# Altium schematic sheet Sensors.SchDoc
size A4; SheetNumber: 4; SheetTotal: 7
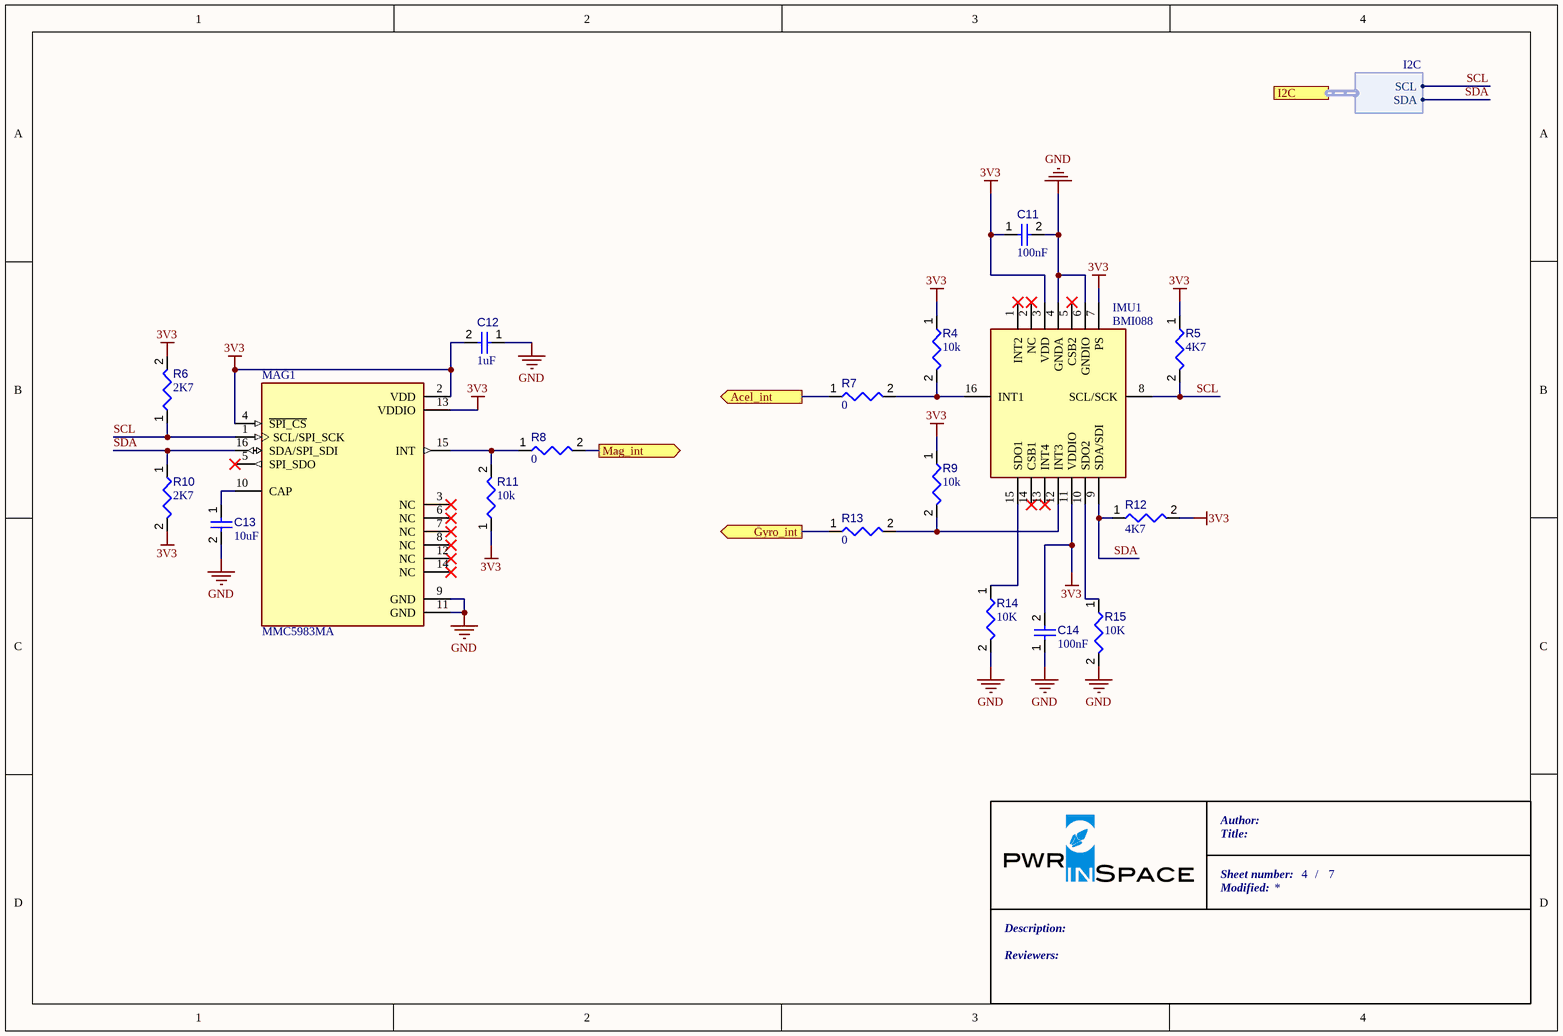
[diagram p0: Sensors.SchDoc]

## Parts
C11  value 100nF  [CAPC0805(2012)145_L]  (hidden comment: Capacitor 100µF +/-20% 6.3V 0805)
C12  value 1uF  [CAPC0805(2012)145_L]  (hidden comment: Capacitor 100µF +/-20% 6.3V 0805)
C13  value 10uF  [CAPC0805(2012)145_L]  (hidden comment: Capacitor 100µF +/-20% 6.3V 0805)
C14  value 100nF  [CAPC0805(2012)145_L]  (hidden comment: Capacitor 100µF +/-20% 6.3V 0805)
IMU1  BMI088  [BMI088]
MAG1  MMC5983MA  [PQFN50P300X300X100-16N]
R4  value 10k  [RESC0805(2012)_L]  (hidden comment: Resistor 4R7  +/-5 % 0805 125 mW)
R5  value 4K7  [RESC0805(2012)_L]  (hidden comment: Resistor 4R7  +/-5 % 0805 125 mW)
R6  value 2K7  [RESC0805(2012)_L]  (hidden comment: Resistor 4R7  +/-5 % 0805 125 mW)
R7  value 0  [RESC0805(2012)_L]  (hidden comment: Resistor 4R7  +/-5 % 0805 125 mW)
R8  value 0  [RESC0805(2012)_L]  (hidden comment: Resistor 4R7  +/-5 % 0805 125 mW)
R9  value 10k  [RESC0805(2012)_L]  (hidden comment: Resistor 4R7  +/-5 % 0805 125 mW)
R10  value 2K7  [RESC0805(2012)_L]  (hidden comment: Resistor 4R7  +/-5 % 0805 125 mW)
R11  value 10k  [RESC0805(2012)_L]  (hidden comment: Resistor 4R7  +/-5 % 0805 125 mW)
R12  value 4K7  [RESC0805(2012)_L]  (hidden comment: Resistor 4R7  +/-5 % 0805 125 mW)
R13  value 0  [RESC0805(2012)_L]  (hidden comment: Resistor 4R7  +/-5 % 0805 125 mW)
R14  value 10K  [RESC0805(2012)_L]  (hidden comment: Resistor 4R7  +/-5 % 0805 125 mW)
R15  value 10K  [RESC0805(2012)_L]  (hidden comment: Resistor 4R7  +/-5 % 0805 125 mW)

## Ports
Acel_int (out), Gyro_int (out), I2C (harness I2C), Mag_int (out)

## Harnesses
I2C: SCL, SDA

## Nets
3V3: C11.1 C12.2 C14.2 IMU1.3(VDD) IMU1.7(PS) IMU1.11(VDDIO) MAG1.2(VDD) MAG1.4(~{SPI_CS}) MAG1.13(VDDIO) R4.1 R5.1 R6.2 R9.1 R10.2 R11.1 R12.2
GND: C11.2 C12.1 C13.2 C14.1 IMU1.4(GNDA) IMU1.6(GNDIO) MAG1.9(GND) MAG1.11(GND) R14.2 R15.2
Acel_int: R7.1 ; port Acel_int
Gyro_int: R13.1 ; port Gyro_int
Mag_int: R8.2 ; port Mag_int
SCL: IMU1.8(SCL/SCK) MAG1.1(SCL/SPI_SCK) R5.2 R6.1 ; port I2C.SCL
SDA: IMU1.9(SDA/SDI) MAG1.16(SDA/SPI_SDI) R10.1 R12.1 ; port I2C.SDA
NetC13_1: C13.1 MAG1.10(CAP)
NetIMU1_10: IMU1.10(SDO2) R15.1
NetIMU1_12: IMU1.12(INT3) R9.2 R13.2
NetIMU1_15: IMU1.15(SDO1) R14.1
NetIMU1_16: IMU1.16(INT1) R4.2 R7.2
NetMAG1_15: MAG1.15(INT) R8.1 R11.2

Not connected (* = marked no-connect by the designer): IMU1 1(INT2)* 2(NC)* 5(CSB2)* 13(INT4)* 14(CSB1)*; MAG1 3(NC)* 5(SPI_SDO)* 6(NC)* 7(NC)* 8(NC)* 12(NC)* 14(NC)*

## Notes on the sheet
- Author:
- Title:
- Sheet number:
- Modified:
- /
- Reviewers:
- Description:

## Library data of the parts
C11-C14 = CMP-001-00054-4: Chip Capacitor, 100µF +/-20%, 6.3V, 0805, Thickness 1.45 mm; Tolerance: 10%; Min Operating Temperature: -55°C; Max Operating Temperature: 85°C; Pins: 2; Mounting Technology: SMT; Case/Package: 0805; Voltage Rating: 6.3V
IMU1 = CMP-003-000006-1: Integrated Circuit; Manufacturer_Name: Bosch Sensortec; Manufacturer_Part_Number: BMI088; Arrow Price/Stock: https://www.arrow.com/en/products/bmi088/bosch?region=europe; Mouser Part Number: 262-BMI088; Arrow Part Number: BMI088; Height: 1.45mm; Source: SamacSys.SchLib; Datasheet Link: https://datasheet.datasheetarchive.com/originals/distributors/Datasheets_SAMA/994c3bf88e91a9e9fead6a819d348e4d.pdf; Design Item ID: BMI088; Mouser Price/Stock: https://www.mouser.co.uk/ProductDetail/Bosch-Sensortec/BMI088?qs=f9yNj16SXrIMFspTV6RB6Q%3D%3D
MAG1 = CMP-004-000030-1: MMC5983 series Magnetic, Magnetometer Sensor Evaluation Board; MF: {'manufacturer': u'Memsic Inc.'}; Pin Count: 16; Availability: Unavailable; Source: MMC5983MA.SchLib; Value: *; Package: None; Component Type: Standard; Price: None; Design Item ID: MMC5983MA; MP: MMC5983MA
R4-R15 = CMP-009-00174-3: Chip Resistor, 4,7 Ohms, +/-5 %, 125 mW, -55 to 155 degC, 0805; Tolerance: 5%; Power: 125mW; Max Operating Temperature: 155°C; Case/Package: 0805; Min Operating Temperature: -55°C; Pins: 2